# Altium schematic sheet TransistorKeyBoard.SchDoc
size A4
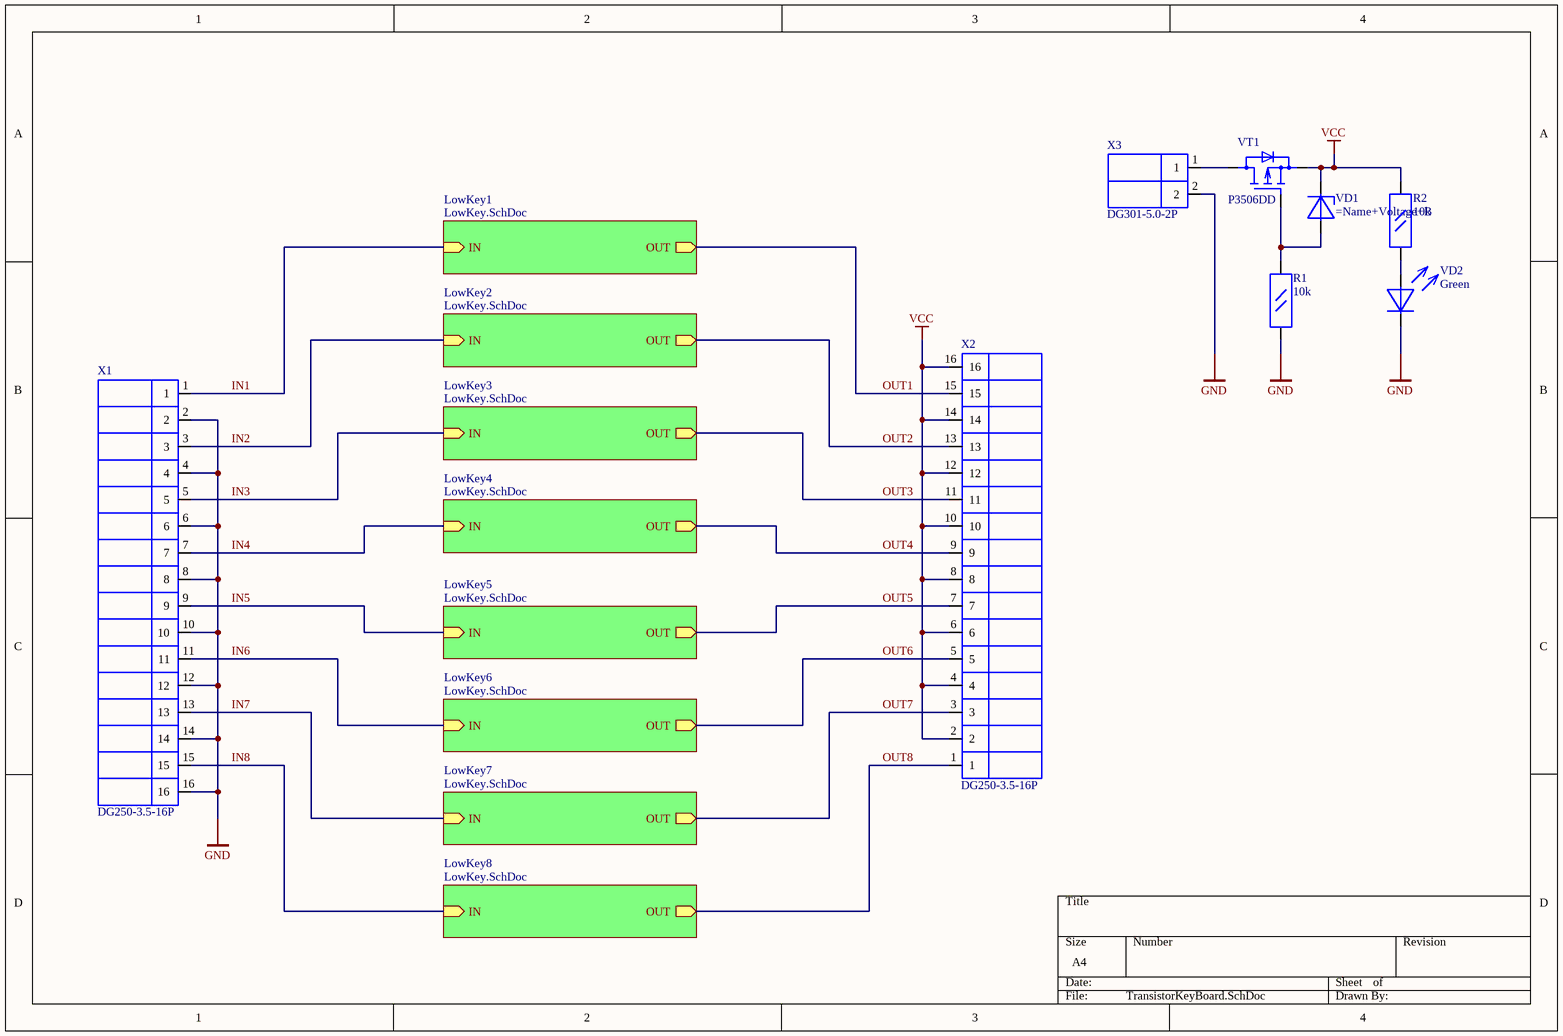
[diagram p0: TransistorKeyBoard.SchDoc]

## Parts
R1  Resistance (Ohms): 10k  [RES0805]  (hidden comment: R0805)
R2  Resistance (Ohms): 10k  [RES0805]  (hidden comment: R0805)
VD1  (no value)  [SOD323]
VD2  Color: Green  [3mm led green]  (hidden comment: Led Green 3mm)
VT1  P3506DD  [DPAK]
X1  DG250-3.5-16P  [DG250-3.5-16P]
X2  DG250-3.5-16P  [DG250-3.5-16P]
X3  DG301-5.0-2P  [DG301-5.0-2P]

## Sub-sheets
LowKey1 = LowKey.SchDoc: IN (in), OUT (out)
LowKey2 = LowKey.SchDoc: IN (in), OUT (out)
LowKey3 = LowKey.SchDoc: IN (in), OUT (out)
LowKey4 = LowKey.SchDoc: IN (in), OUT (out)
LowKey5 = LowKey.SchDoc: IN (in), OUT (out)
LowKey6 = LowKey.SchDoc: IN (in), OUT (out)
LowKey7 = LowKey.SchDoc: IN (in), OUT (out)
LowKey8 = LowKey.SchDoc: IN (in), OUT (out)

## Nets
GND: R1.1 VD2.1(C) X1.2 X1.4 X1.6 X1.8 X1.10 X1.12 X1.14 X1.16 X3.2
VCC: R2.2 VD1.1(C) VT1.3(S) X2.2 X2.4 X2.6 X2.8 X2.10 X2.12 X2.14 X2.16
IN1: X1.1 ; sheet LowKey1/IN
IN2: X1.3 ; sheet LowKey2/IN
IN3: X1.5 ; sheet LowKey3/IN
IN4: X1.7 ; sheet LowKey4/IN
IN5: X1.9 ; sheet LowKey5/IN
IN6: X1.11 ; sheet LowKey6/IN
IN7: X1.13 ; sheet LowKey7/IN
IN8: X1.15 ; sheet LowKey8/IN
OUT1: X2.15 ; sheet LowKey1/OUT
OUT2: X2.13 ; sheet LowKey2/OUT
OUT3: X2.11 ; sheet LowKey3/OUT
OUT4: X2.9 ; sheet LowKey4/OUT
OUT5: X2.7 ; sheet LowKey5/OUT
OUT6: X2.5 ; sheet LowKey6/OUT
OUT7: X2.3 ; sheet LowKey7/OUT
OUT8: X2.1 ; sheet LowKey8/OUT
NetR1_2: R1.2 VD1.2(A) VT1.1(G)
NetR2_1: R2.1 VD2.2(A)
NetVT1_2: VT1.2(D) X3.1

## Library data of the parts
R1 R2 = R0805: Resistor; Power (Watts): 1/8W; Package: 0805; Category: Resistors
VD1 = PDZ-B: Diode; Name: PDZ; Voltage: 12; Package: SOD323
VD2 = Led Green 3mm: 3mm Green Led 2.54pitch
VT1 = P3506DD: P-channel MOSFET transistor; Manufacturer: NIKO SEMICONDUCTOR CO; Package: D-PAK(TO-252); Name: P3506DD
X1 X2 = DG250-3.5-16P: 5mm Pitch PCB Terminal Block Connector; Manufacture: DEGSON; Name: DG250-3.5-16P; Pitch: 5mm
X3 = DG301-5.0-2P: 5mm Pitch PCB Terminal Block Connector; Manufacture: DEGSON; Name: DG301-5.0-2P; Pitch: 5mm